# Altium project MaverickPowerDistribution_v1.0.PrjPcb
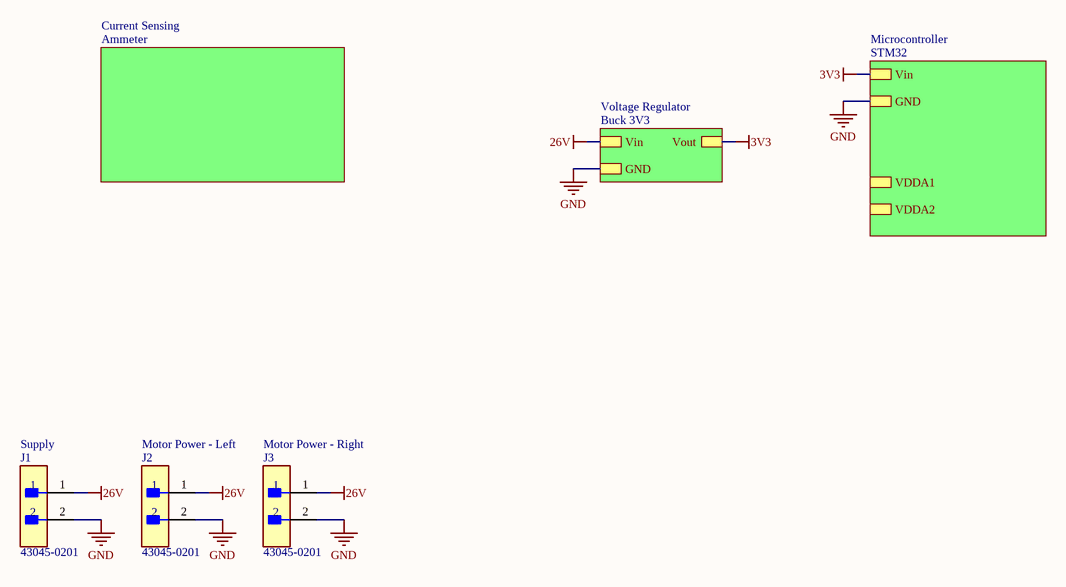
[diagram p0: Power.SchDoc]
7 sheets, 6 parts. Net scope: hierarchical (ports join the sheet entries above them; power ports are global).
Board file: PCB1.PcbDoc
Sheets:
  Power.SchDoc
    Current Sensing = Ammeter.SchDoc
    Microcontroller = STM32.SchDoc
      Designator = Display.SchDoc
      Designator = SD Card.SchDoc
    Voltage Regulator = Buck 3V3.SchDoc
  ADC.SchDoc

## Sheet Power.SchDoc
size A; SheetNumber: 1; SheetTotal: 7

### Parts
J1  43045-0201  [FP-43045-0201-MFG]
J2  43045-0201  [FP-43045-0201-MFG]
J3  43045-0201  [FP-43045-0201-MFG]

### Sub-sheets
Current Sensing = Ammeter: no entries
Microcontroller = STM32: Vin, GND, VDDA1, VDDA2
Voltage Regulator = Buck 3V3: Vin, GND, Vout

### Nets
3V3: sheet Microcontroller/Vin, sheet Voltage Regulator/Vout
26V: J1.1 J2.1 J3.1 ; sheet Voltage Regulator/Vin
GND: J1.2 J2.2 J3.2 ; sheet Microcontroller/GND, sheet Voltage Regulator/GND

### Notes on the sheet
- (near J1) Supply
- Motor Power - Left
- (near J3) Motor Power - Right

### Library data of the parts
J1-J3 = CMP-04776-000998-1: CONN HEADER R/A 2POS; Number of Circuits: 2; Glow Wire Compliant: Compliant; Pitch: 3mm; Max Voltage Rating (DC): 250.25kV; Current Rating: 5A; Contact Resistance: 10mR; Gender: Male; Voltage Rating: 250V; Number of Positions: 2; Halogen Free: Low Halogen; Series: 43045; Mount: Through Hole; Packaging: Tray; Row Spacing: 3mm; Contact Material: Brass; Radiation Hardening: No; Number of Contacts: 2; Orientation: Right Angle; Max Operating Temperature: 105°C; Housing Material: Thermoplastic; Contact Plating: Gold; Case/Package: 0201; Number of Rows: 2; Min Operating Temperature: -40°C; Termination: Solder; Package Quantity: 3168

## Sheet Ammeter.SchDoc
size A; SheetNumber: 5; SheetTotal: 7

## Sheet STM32.SchDoc
size A; SheetNumber: 2; SheetTotal: 7
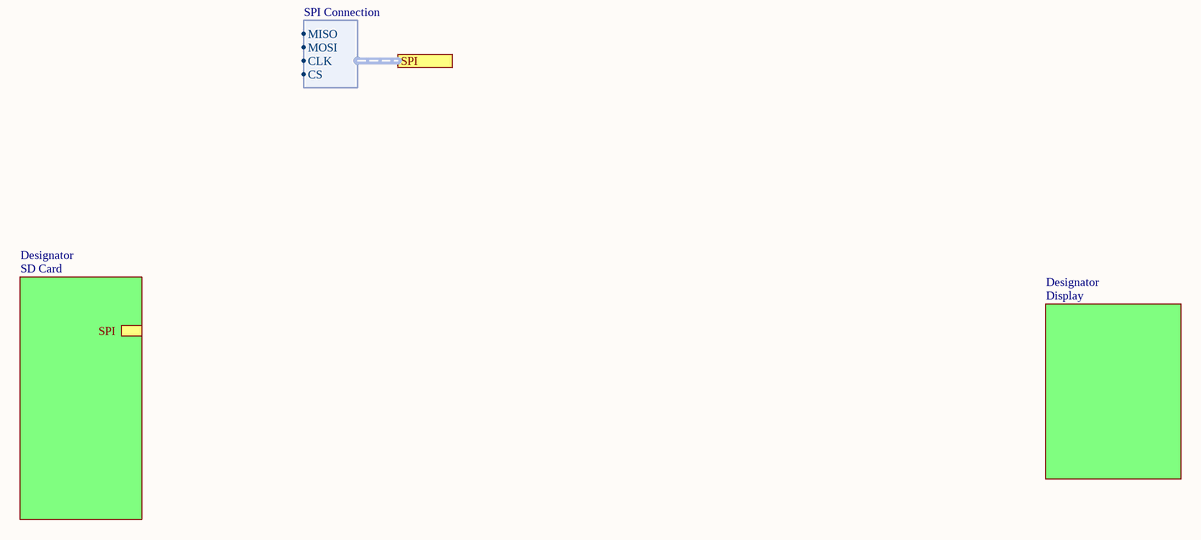
[diagram p1: STM32.SchDoc]

### Sub-sheets
Designator = Display: no entries
Designator = SD Card: SPI (harness SPI Connection)

### Ports
SPI (harness SPI Connection)

### Harnesses
SPI Connection: MISO, MOSI, CLK, CS

## Sheet Display.SchDoc
size A; SheetNumber: 4; SheetTotal: 7

## Sheet SD Card.SchDoc
size A; SheetNumber: 3; SheetTotal: 7
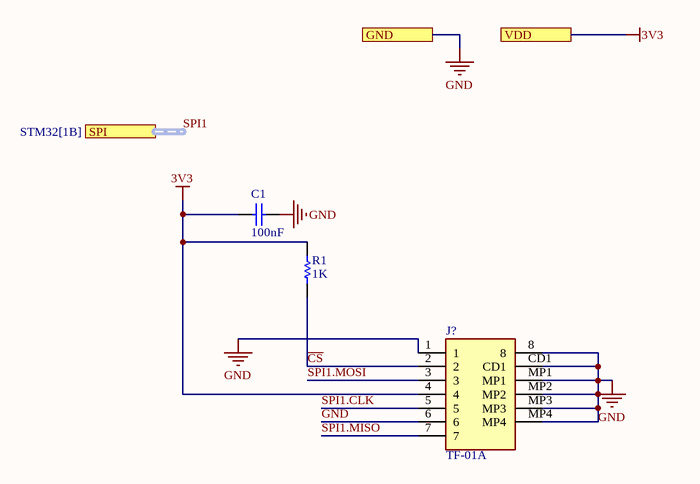
[diagram p2: SD Card.SchDoc]

### Parts
C1  value 100nF  (hidden comment: Capacitor)
J?  TF-01A  [TF01A]
R1  value 1K  (hidden comment: Resistor)

### Ports
GND, SPI (harness SPI Connection, see STM32[1B]), VDD

### Nets
3V3: C1.1 J?.4 R1.2 ; port VDD
GND: C1.2 J?.1 J?.6 J?.8 J?.CD1 J?.MP1 J?.MP2 J?.MP3 J?.MP4 ; port GND
~{CS}: J?.2 R1.1
SPI1.CLK: J?.5
SPI1.MISO: J?.7
SPI1.MOSI: J?.3

### Buses and harness runs
harness SPI1 = port SPI

### Library data of the parts
C1 = Capacitor: SimulationGenericComponent: True
J? = TF-01A: Connector; Manufacturer_Name: Korean Hroparts Elec; Datasheet Link: https://datasheet.lcsc.com/szlcsc/1903221101_Korean-Hroparts-Elec-TF-01A_C91145.pdf; Height: 1.85mm; Manufacturer_Part_Number: TF-01A
R1 = Resistor: TC1: 0; SimulationGenericComponent: True; TC2: 0

## Sheet Buck 3V3.SchDoc
size A; SheetNumber: 6; SheetTotal: 7
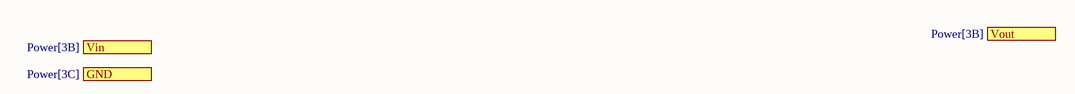
[diagram p3: Buck 3V3.SchDoc]

### Ports
GND (see Power[3C]), Vin (see Power[3B]), Vout (see Power[3B])

## Sheet ADC.SchDoc
size A; SheetNumber: 5; SheetTotal: 6

## Nets that join several sheets
GND: Power (J1.2 J2.2 J3.2), SD Card (9 pins)